# EAGLE design w5500_spi (EAGLE 7.6.0)
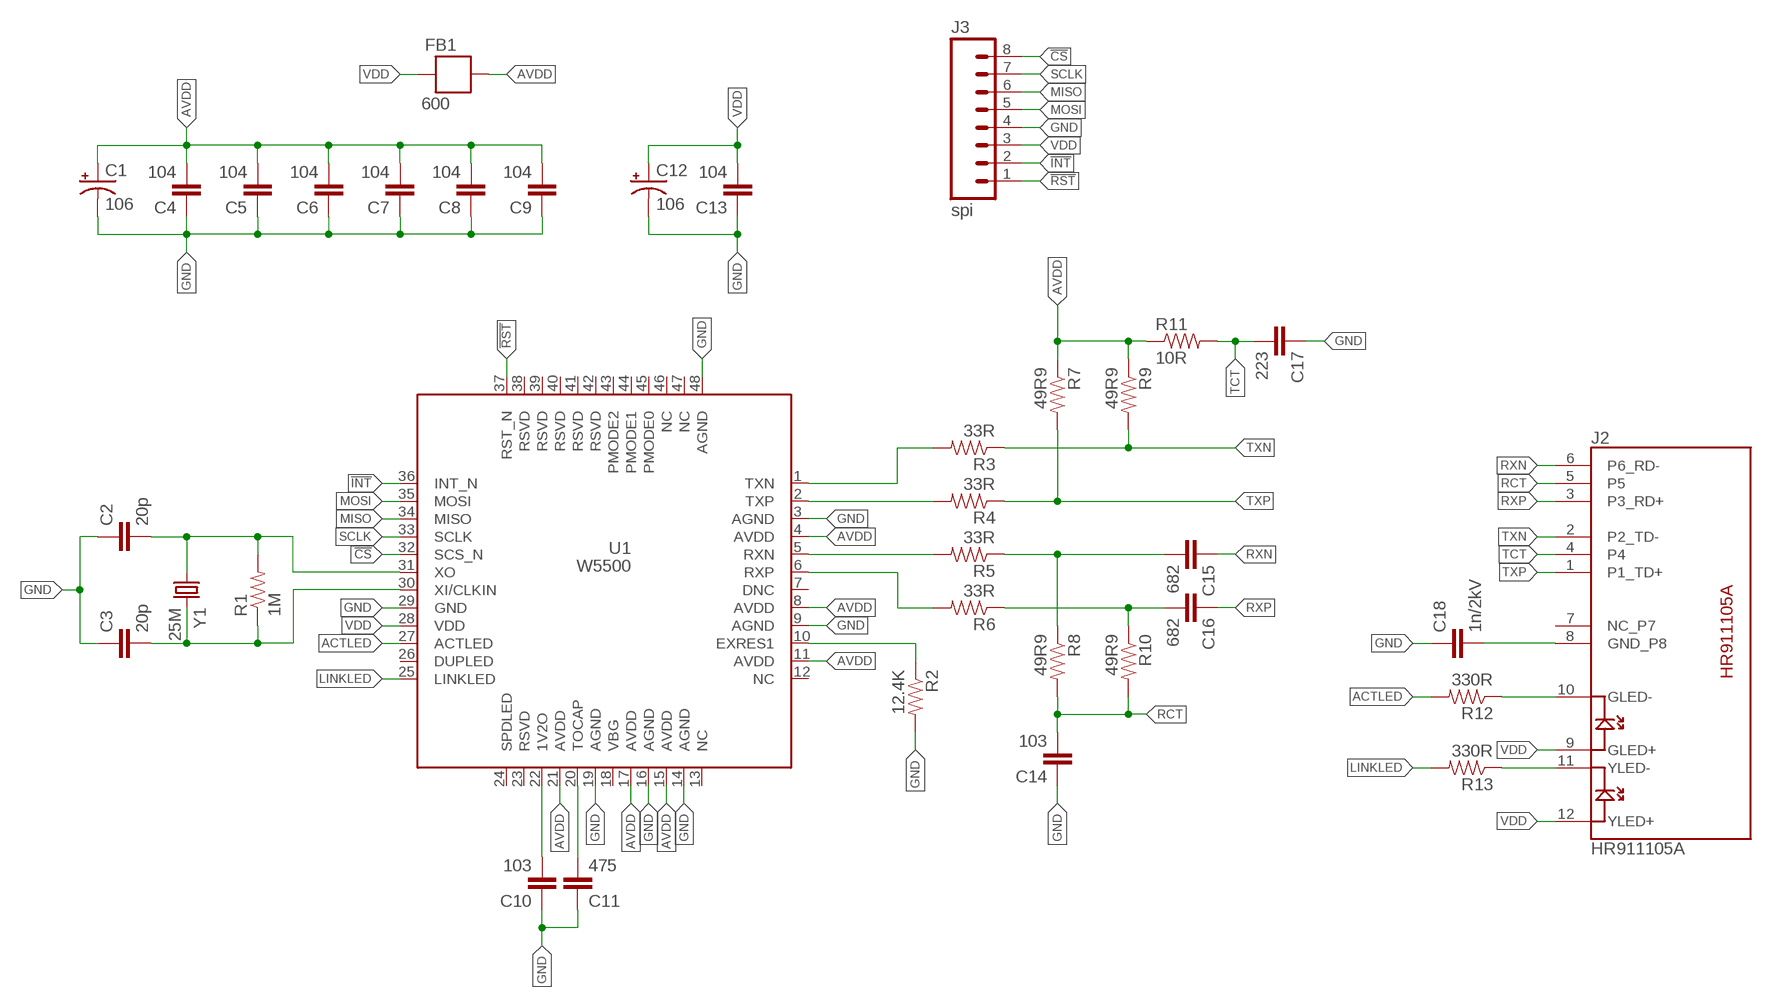
[diagram p0: schematic, sheet 1]

## Parts
C1  106  CAP_POL1206  [EIA3216]
C2  20p  CAP0603-CAP  [0603-CAP]
C3  20p  CAP0603-CAP  [0603-CAP]
C4  104  CAP0603-CAP  [0603-CAP]
C5  104  CAP0603-CAP  [0603-CAP]
C6  104  CAP0603-CAP  [0603-CAP]
C7  104  CAP0603-CAP  [0603-CAP]
C8  104  CAP0603-CAP  [0603-CAP]
C9  104  CAP0603-CAP  [0603-CAP]
C10  103  CAP0603-CAP  [0603-CAP]
C11  475  CAP0603-CAP  [0603-CAP]
C12  106  CAP_POL1206  [EIA3216]
C13  104  CAP0603-CAP  [0603-CAP]
C14  103  CAP0603-CAP  [0603-CAP]
C15  682  CAP0603-CAP  [0603-CAP]
C16  682  CAP0603-CAP  [0603-CAP]
C17  223  CAP0603-CAP  [0603-CAP]
C18  1n/2kV  CAP1206  [1206]
FB1  600  FB0805  [0805]
J2  HR911105A  [HR911105A]
J3  spi  M08NO_SILK  [1X08_PIN1_NO_SILK]
R1  1M  RESISTOR0603  [0603-RES]
R2  12.4K  RESISTOR0603  [0603-RES]
R3  33R  RESISTOR0603-RES  [0603-RES]
R4  33R  RESISTOR0603  [0603-RES]
R5  33R  RESISTOR0603  [0603-RES]
R6  33R  RESISTOR0603  [0603-RES]
R7  49R9  RESISTOR0603  [0603-RES]
R8  49R9  RESISTOR0603  [0603-RES]
R9  49R9  RESISTOR0603  [0603-RES]
R10  49R9  RESISTOR0603  [0603-RES]
R11  10R  RESISTOR0603  [0603-RES]
R12  330R  RESISTOR0603  [0603-RES]
R13  330R  RESISTOR0603  [0603-RES]
U1  W5500  [LQFP-48]
Y1  25M  CRYSTALHC49US  [HC49US]

## Nets
!CS: J3.8 U1.32(SCS_N)
!INT: J3.2 U1.36(INT_N)
!RST: J3.1 U1.37(RST_N)
ACTLED: R12.2 U1.27(ACTLED)
AVDD: C1.A(+) C4.2 C5.2 C6.2 C7.2 C8.2 C9.2 FB1.1 R7.1 R9.1 R11.1 U1.4(AVDD) U1.8(AVDD) U1.11(AVDD) U1.15(AVDD) U1.17(AVDD) U1.21(AVDD)
GND: C1.C(-) C2.1 C3.1 C4.1 C5.1 C6.1 C7.1 C8.1 C9.1 C10.1 C11.1 C12.C(-) C13.1 C14.1 C17.1 C18.1 J3.4 R2.2 U1.3(AGND) U1.9(AGND) U1.14(AGND) U1.16(AGND) U1.19(AGND) U1.29(GND) U1.48(AGND)
LINKLED: R13.2 U1.25(LINKLED)
MISO: J3.6 U1.34(MISO)
MOSI: J3.5 U1.35(MOSI)
N$1: C2.2 R1.2 U1.31(XO) Y1.1
N$2: C10.2 U1.22(1V2O)
N$3: C11.2 U1.20(TOCAP)
N$4: C3.2 R1.1 U1.30(XI/CLKIN) Y1.2
N$5: R2.1 U1.10(EXRES1)
N$6: J2.10(GLED-) R12.1
N$7: J2.11(YLED-) R13.1
N$8: R3.2 U1.1(TXN)
N$9: R4.2 U1.2(TXP)
N$10: R5.2 U1.5(RXN)
N$11: R6.2 U1.6(RXP)
N$12: C18.2 J2.8(GND_P8)
N$14: C15.2 R5.1 R8.1
N$15: C16.2 R6.1 R10.1
RCT: C14.2 J2.5 R8.2 R10.2
RXN: C15.1 J2.6(P6_RD-)
RXP: C16.1 J2.3(P3_RD+)
SCLK: J3.7 U1.33(SCLK)
TCT: C17.2 J2.4 R11.2
TXN: J2.2(P2_TD-) R3.1 R9.2
TXP: J2.1(P1_TD+) R4.1 R7.2
VDD: C12.A(+) C13.2 FB1.2 J2.9(GLED+) J2.12(YLED+) J3.3 U1.28(VDD)
Unconnected: J2.7(NC_P7) U1.7(DNC) U1.12(NC) U1.13(NC) U1.18(VBG) U1.23(RSVD) U1.24(SPDLED) U1.26(DUPLED) U1.38(RSVD) U1.39(RSVD) U1.40(RSVD) U1.41(RSVD) U1.42(RSVD) U1.43(PMODE2) U1.44(PMODE1) U1.45(PMODE0) U1.46(NC) U1.47(NC)

## Library data of the parts
C1 C12 = z_jlc_smt:CAP_POL: Capacitor Polarized These are standard SMD and PTH capacitors. Normally 10uF, 47uF, and 100uF in electrolytic and tantalum varieties. Always verify the external diameter of the through hole cap, it varies with capacity, voltage, and manufacturer. The EIA devices should be standard.
C2 C3 C5-C11 C13-C18 = z_jlc_smt:CAP: Capacitor Standard 0603 ceramic capacitor, and 0.1" leaded capacitor.
C4 = xmgu2008:CAP: Capacitor Standard 0603 ceramic capacitor, and 0.1" leaded capacitor.
FB1 = xmgu2008:FB
J2 = DECADE-libraries20151104:HR911105A: RJ-45 with LEDs
J3 = SparkFun-Connectors:M08: Header 8 Standard 8-pin 0.1" header. Use with straight break away headers (SKU : PRT-00116), right angle break away headers (PRT-00553), swiss pins (PRT-00743), machine pins (PRT-00117), and female headers (PRT-00115).
R1 R2 R4-R13 = z_jlc_smt:RESISTOR: Resistor Basic schematic elements and footprints for 0603, 1206, and PTH resistors.
R3 = xmgu2008:RESISTOR: Resistor Basic schematic elements and footprints for 0603, 1206, and PTH resistors.
U1 = xmgu2008:W5500
Y1 = xmgu2008:CRYSTAL: Various standard crystals. Proven footprints.

## Net classes
1 VDD: width 1.27 mm

## Board
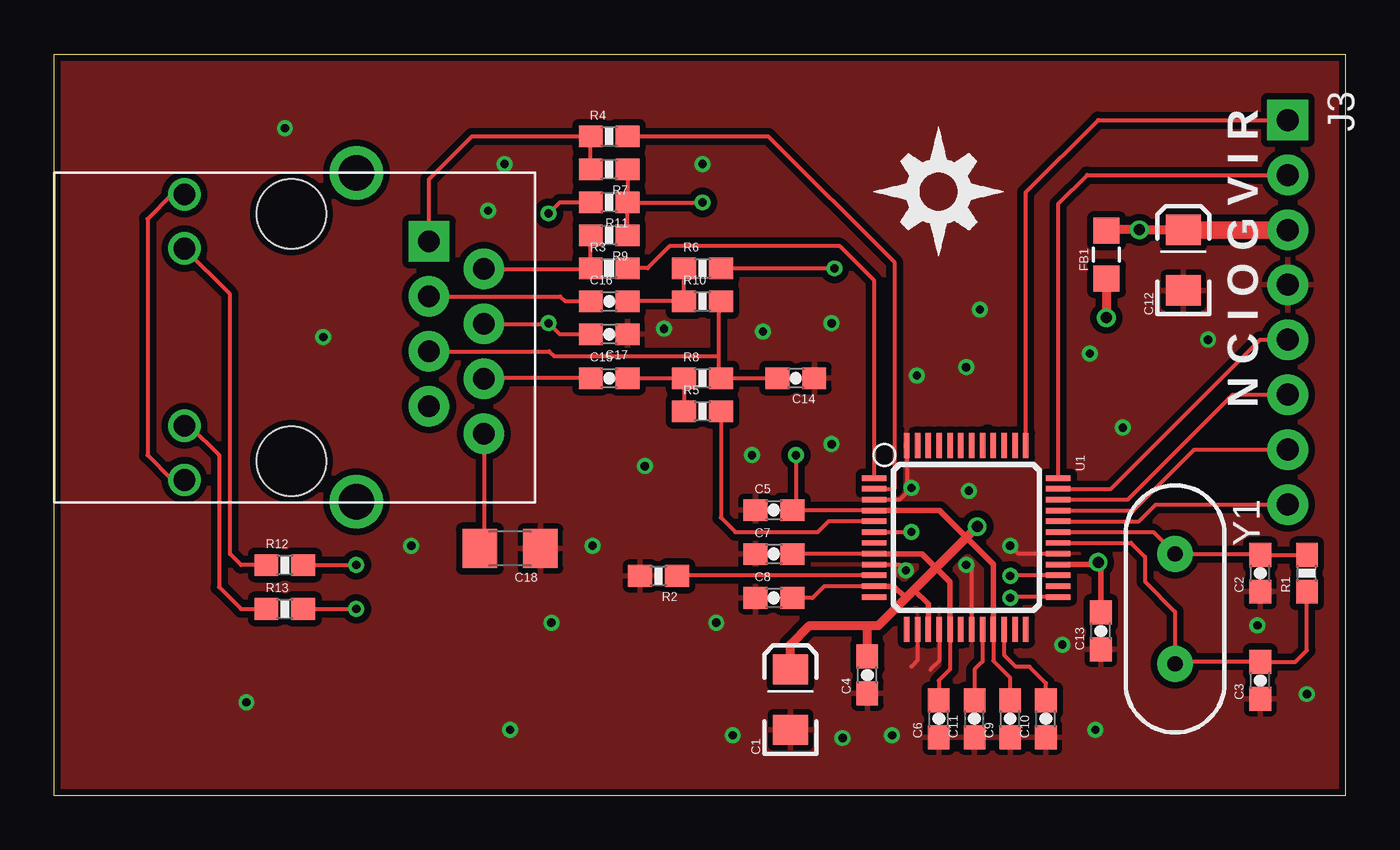
[diagram p1: board, top side]
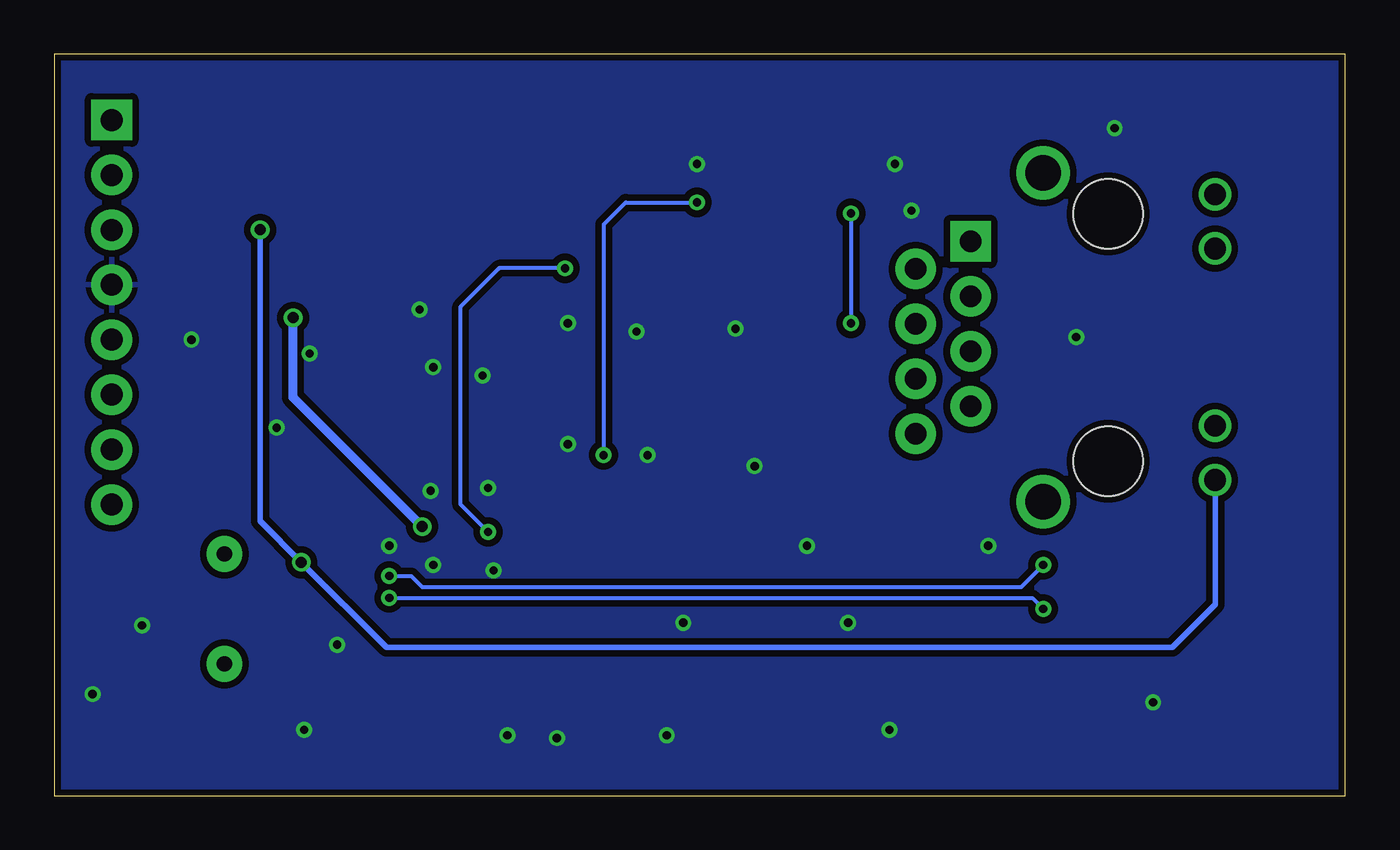
[diagram p2: board, bottom side, seen from below]

Size 59.69 x 34.29 mm. Coordinates in mm from the lower left corner, seen from the top.
Outline: 0,0 0,34.29 59.69,34.29 59.69,0 0,0
Copper layers (1*16): Top 0.035mm / dielectric 1.5mm / Bottom 0.035mm
Design rules "SparkFun-2-layer-TIGHT": minimum track width 7mil, minimum drill 15mil, track to track 7mil, track to pad 7mil, pad to pad 7mil, via to via 7mil, smd to smd 7mil, copper to edge 7mil, drill to drill 7mil, minimum pad ring 7mil, minimum via ring 7mil, stop-mask expansion 4mil, vias tented up to drill 20mil, thermal gap 10mil

### Footprints (pad centres in the part's own frame; a part is rotated, then mirrored left to right if it is on the bottom)
EIA3216 = smd 1.4 x 1.6: A 1.4,0; C -1.4,0
0603-CAP = smd 1.1 x 1: 1 -0.85,0; 2 0.85,0
1206 = smd 1.6 x 1.8: 1 -1.4,0; 2 1.4,0
0805 = smd 1.2 x 1.2: 1 -1.1,0; 2 1.1,0
HR911105A = drill 1 pad 1.88 square: 1 5.05,2.485 | drill 1 pad 1.88: 2 3.78,-0.055; 3 2.51,2.485; 4 1.24,-0.055; 5 -0.03,2.485; 6 -1.3,-0.055; 7 -2.57,2.485; 8 -3.84,-0.055 | drill 1 pad 1.27: 9 7.225,13.79; 10 4.725,13.79; 11 -3.475,13.79; 12 -5.975,13.79 | drill 1.65 pad 2.184: M1 8.225,5.84; M2 -6.975,5.84 | hole 3.2: 6.32,8.835; -5.11,8.835
1X08_PIN1_NO_SILK = drill 1.016 pad 1.88 square: 1 0,0 | drill 1.016 pad 1.88: 2 2.54,0; 3 5.08,0; 4 7.62,0; 5 10.16,0; 6 12.7,0; 7 15.24,0; 8 17.78,0
0603-RES = smd 1.1 x 1: 1 -0.85,0; 2 0.85,0
LQFP-48 = smd 0.254 x 1.143: 1 -2.75,-4.25; 2 -2.25,-4.25; 3 -1.75,-4.25; 4 -1.25,-4.25; 5 -0.75,-4.25; 6 -0.25,-4.25; 7 0.25,-4.25; 8 0.75,-4.25; 9 1.25,-4.25; 10 1.75,-4.25; 11 2.25,-4.25; 12 2.75,-4.25; 25 2.75,4.25; 26 2.25,4.25; 27 1.75,4.25; 28 1.25,4.25; 29 0.75,4.25; 30 0.25,4.25; 31 -0.25,4.25; 32 -0.75,4.25; 33 -1.25,4.25; 34 -1.75,4.25; 35 -2.25,4.25; 36 -2.75,4.25 | smd 1.143 x 0.254: 13 4.25,-2.75; 14 4.25,-2.25; 15 4.25,-1.75; 16 4.25,-1.25; 17 4.25,-0.75; 18 4.25,-0.25; 19 4.25,0.25; 20 4.25,0.75; 21 4.25,1.25; 22 4.25,1.75; 23 4.25,2.25; 24 4.25,2.75; 37 -4.25,2.75; 38 -4.25,2.25; 39 -4.25,1.75; 40 -4.25,1.25; 41 -4.25,0.75; 42 -4.25,0.25; 43 -4.25,-0.25; 44 -4.25,-0.75; 45 -4.25,-1.25; 46 -4.25,-1.75; 47 -4.25,-2.25; 48 -4.25,-2.75
HC49US = drill 0.7 pad 1.651: 1 -2.54,0; 2 2.54,0

### Placement (x,y rotation side)
C1  34.04,4.45 90 top
C2  55.75,10.29 90 top
C3  55.75,5.33 90 top
C4  37.59,5.59 90 top
C5  33.27,13.21 0 top
C6  40.89,3.56 90 top
C7  33.27,11.18 0 top
C8  33.27,9.14 0 top
C9  44.2,3.56 90 top
C10  45.85,3.56 90 top
C11  42.55,3.56 90 top
C12  52.2,24.77 90 top
C13  48.39,7.62 90 top
C14  34.29,19.3 180 top
C15  25.65,19.3 0 top
C16  25.65,22.86 0 top
C17  25.65,21.34 180 top
C18  21.08,11.43 180 top
FB1  48.64,25.02 90 top
J2  19.81,20.57 90 top
J3  57.02,31.24 270 top
R1  57.91,10.29 90 top
R2  27.94,10.16 180 top
R3  25.65,24.38 0 top
R4  25.65,30.48 0 top
R5  29.97,17.78 0 top
R6  29.97,24.38 0 top
R7  25.65,28.96 180 top
R8  29.97,19.3 0 top
R9  25.65,25.91 180 top
R10  29.97,22.86 0 top
R11  25.65,27.43 180 top
R12  10.67,10.67 0 top
R13  10.67,8.64 0 top
U1  42.16,11.94 270 top
U$1  [DIYNOVA_LOGO]  37.85,24.89 0 top
Y1  51.82,8.64 270 top

### Tracks (layer width: path | path; a pad name or v marks a point on that pad's centre or on a via)
!CS
  Top 0.178: U1.32 50.15,12.69 50.93,13.46 J3.8
!INT
  Top 0.178: U1.36 46.41,27.36 47.75,28.7 J3.2
!RST
  Top 0.178: U1.37 44.91,27.9 48.26,31.24 J3.1
ACTLED  (via drill 0.38)
  Top 0.178: R12.2 v13.97,10.67 | U1.27 44.22,10.19 v44.2,10.16
  Bottom 0.178: v44.2,10.16 43.18,10.16 42.67,9.65 14.99,9.65 v13.97,10.67
AVDD  (via drill 0.38, 0.51)
  Top 0.178: R9.1 R11.1 | R7.1 R11.1 | R11.1 v29.97,27.43 | U1.11 35.6,9.69 35.05,9.14 C8.2 | v34.29,15.75 34.29,13.37 C5.2 37.89,13.21 U1.4 | U1.8 34.14,11.19 C7.2 | U1.17 41.41,5.85 40.89,5.33 C6.2 | C9.2 44.2,5.46 43.41,6.24 U1.21
  Top 0.254: U1.15 40.41,8.86 39.75,9.53 | U1.4 40.91,13.19 42.16,11.94 43.41,10.69 U1.21 | U1.8 40.12,11.19 40.77,10.54 41.41,9.89 U1.17 | U1.11 38.83,9.69 39.37,9.14
  Top 0.406: 37.59,7.87 38.1,7.87 39.37,9.14 39.75,9.53 40.77,10.54 42.16,11.94 v42.67,12.45 | C4.2 37.59,7.87 | C1.A 34.04,6.99 34.92,7.87 37.59,7.87 | FB1.1 v48.64,22.1
  Bottom 0.178: v34.29,15.75 34.29,26.42 33.27,27.43 v29.97,27.43
  Bottom 0.406: v42.67,12.45 48.64,18.41 v48.64,22.1
GND  (via drill 0.38)
  Top 0.178: U1.9 39.1,10.69 v39.37,10.41 | U1.19 42.41,10.42 v42.16,10.67 | U1.3 39.09,13.69 v39.62,14.22 39.41,14.43 U1.48 | U1.16 40.91,6.24 40.51,5.84 | U1.14 39.91,6.26 39.62,5.97 | U1.29 44.56,11.19 v44.2,11.56
  other vias: 38.73,2.79 30.61,8 42.16,19.81 47.88,20.45 53.34,21.08 57.91,4.7 20.83,29.21 32.26,15.75 28.19,21.59 29.97,29.21 21.08,3.05 8.89,4.32 55.63,7.87 49.4,17.02 46.61,6.99 35.94,16.26 27.3,15.24 42.29,14.1 48.13,3.05 36.45,2.67 31.37,2.79 22.99,8 24.89,11.56 16.51,11.56 12.45,21.21 10.67,30.86 20.07,27.05 42.8,22.48 39.88,19.43 35.94,21.84 32.77,21.46
  pour Top (isolate 0.305): 0,0 0,34.29 59.69,34.29 59.69,0
  pour Bottom (isolate 0.305): 0,0 0,34.29 59.69,34.29 59.69,0
LINKLED  (via drill 0.38)
  Top 0.178: R13.2 v13.97,8.64 | U1.25 44.24,9.19 v44.2,9.14
  Bottom 0.178: v44.2,9.14 14.48,9.14 v13.97,8.64
MISO
  Top 0.178: U1.34 49.63,13.69 54.48,18.54 J3.6
MOSI
  Top 0.178: U1.35 48.86,14.19 55.75,21.08 J3.5
N$1
  Top 0.178: U1.31 50.8,12.19 Y1.1 55.71,11.18 C2.2 R1.2
N$2
  Top 0.178: C10.2 45.85,5.21 45.09,5.97 44.45,5.97 43.91,6.5 U1.22
N$3
  Top 0.178: U1.20 42.91,6.21 42.55,5.84 C11.2
N$4
  Top 0.178: U1.30 49.78,11.69 50.42,11.05 50.42,9.91 51.82,8.51 Y1.2 51.9,6.18 C3.2 57.37,6.18 57.91,6.73 R1.1
N$5
  Top 0.178: U1.10 28.82,10.19 R2.1
N$6
  Top 0.178: R12.1 8.64,10.67 8.13,11.18 8.13,23.19 J2.10
N$7
  Top 0.178: J2.11 6.27,17.1 7.62,15.75 7.62,9.65 8.64,8.64 R13.1
N$8
  Top 0.178: R3.2 27.43,24.38 28.45,25.4 36.32,25.4 37.91,23.81 U1.1
N$9
  Top 0.178: U1.2 38.83,14.19 38.86,14.22 38.86,24.64 33.02,30.48 R4.2
N$10
  Top 0.178: R5.2 30.82,12.87 31.5,12.19 35.31,12.19 35.8,12.69 U1.5
N$11  (via drill 0.38)
  Top 0.178: R6.2 v36.07,24.38 | U1.6 v39.62,12.19
  Bottom 0.178: v39.62,12.19 40.89,13.46 40.89,22.61 39.12,24.38 v36.07,24.38
N$12
  Top 0.178: J2.8 19.87,11.62 C18.2
N$14
  Top 0.178: C15.2 R8.1 R5.1
N$15
  Top 0.178: C16.2 R10.1 R6.1
RCT
  Top 0.178: C14.2 R8.2 30.73,19.39 30.73,20.32 | 30.73,20.32 30.73,22.77 R10.2 | J2.5 22.89,20.54 23.11,20.32 30.73,20.32
RXN
  Top 0.178: C15.1 19.9,19.3 J2.6
RXP
  Top 0.178: J2.3 23.4,23.08 23.62,22.86 C16.1
SCLK
  Top 0.178: U1.33 49.89,13.19 52.7,16 J3.7
TCT  (via drill 0.38)
  Top 0.178: C17.2 23.37,21.34 v22.86,21.84 22.83,21.81 J2.4 | R11.2 23.37,27.43 v22.86,26.92
  Bottom 0.178: v22.86,26.92 v22.86,21.84
TXN
  Top 0.178: J2.2 24.77,24.35 R3.1 R9.2
TXP
  Top 0.178: J2.1 17.33,28.5 19.3,30.48 R4.1 R7.2
VDD  (via drill 0.51)
  Top 0.178: J2.9 5.45,27.8 4.32,26.67 4.32,15.75 5.47,14.6 J2.12
  Top 0.254: U1.28 48.15,10.69 v48.26,10.79 48.39,10.67 C13.2
  Top 0.406: C12.A v50.17,26.16 v50.16,26.16 48.69,26.16 FB1.2
  Top 0.813: J3.3 C12.A
  Bottom 0.254: J2.12 6.02,8.84 8,6.86 44.32,6.86 v48.26,10.79 50.16,12.7 v50.16,26.16

### Text on the board
tPlace: N C I O G V I R